# Altium project Snake game PCB.PrjPcb
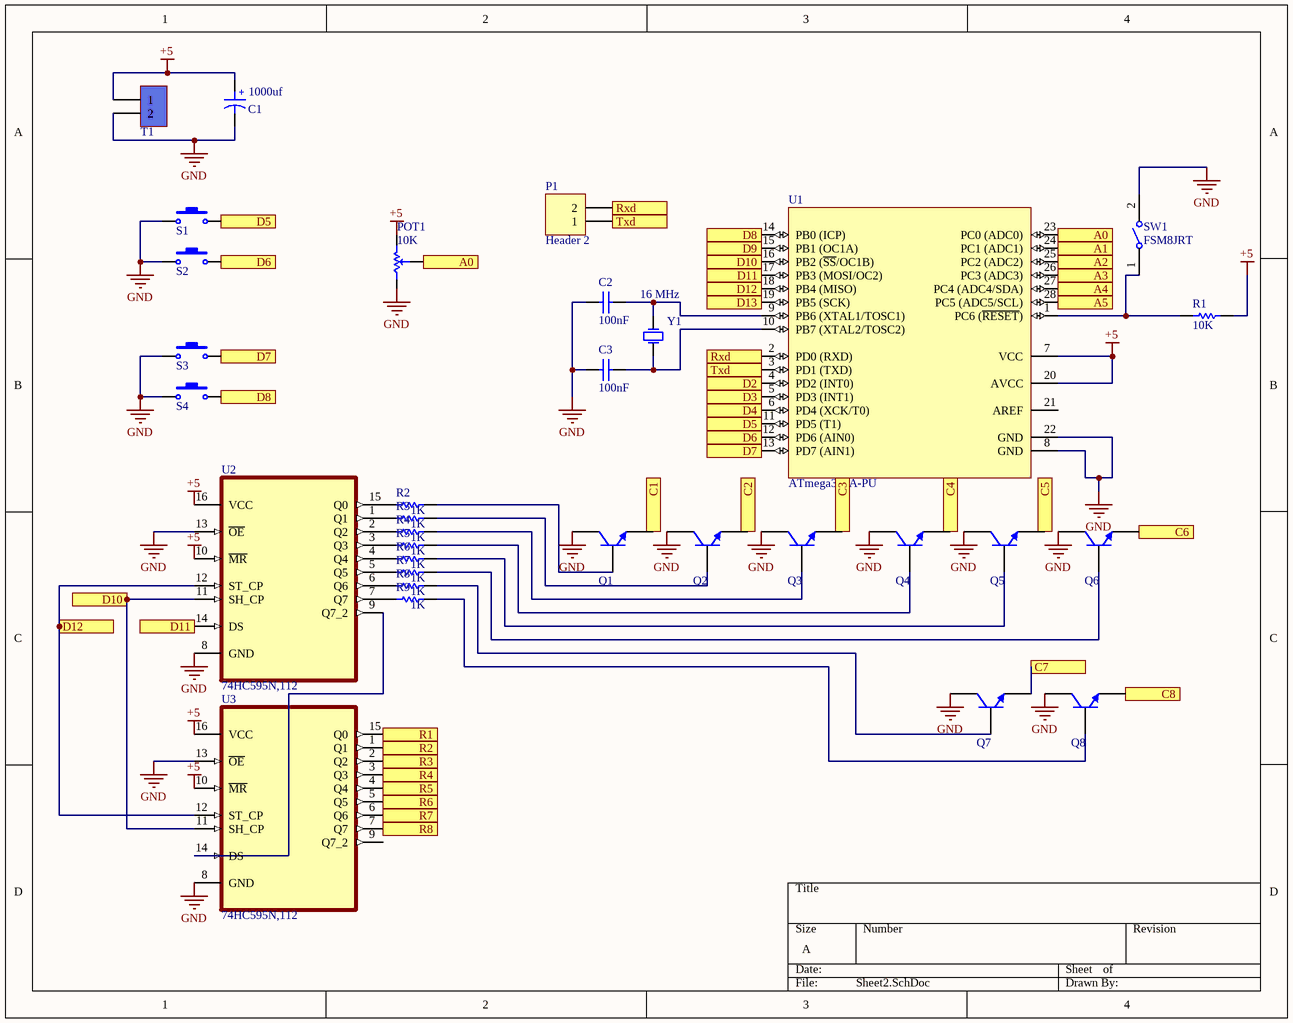
[diagram p0: Sheet2.SchDoc]
2 sheets, 104 parts. Net scope: flat (ports and power ports of the same name join across sheets).
Board file: PCB1.PcbDoc
Sheets:
  Sheet2.SchDoc
  Sheet1.SchDoc

## Sheet Sheet2.SchDoc
size A

### Parts
C1  1000uf  [Cap electrolitic radial 10x20-5]
C2  100nF  [Cap-100nF]
C3  100nF  [Cap-100nF]
P1  Header 2  [HDR1X2]
POT1  10K  [POT]
Q1  BC547  [TO-92 STR]  (value not drawn)
Q2  BC547  [TO-92 STR]  (value not drawn)
Q3  BC547  [TO-92 STR]  (value not drawn)
Q4  BC547  [TO-92 STR]  (value not drawn)
Q5  BC547  [TO-92 STR]  (value not drawn)
Q6  BC547  [TO-92 STR]  (value not drawn)
Q7  BC547  [TO-92 STR]  (value not drawn)
Q8  BC547  [TO-92 STR]  (value not drawn)
R1  10K  [RES-(1/4)]
R2  1K  [RES1206]
R3  1K  [RES1206]
R4  1K  [RES1206]
R5  1K  [RES1206]
R6  1K  [RES1206]
R7  1K  [RES1206]
R8  1K  [RES1206]
R9  1K  [RES1206]
S1  Switch PB  [Switch - Push to On]  (value not drawn)
S2  Switch PB  [Switch - Push to On]  (value not drawn)
S3  Switch PB  [Switch - Push to On]  (value not drawn)
S4  Switch PB  [Switch - Push to On]  (value not drawn)
SW1  FSM8JRT  [TE_FSM8JRT]
T1  Terminal  [Terminal 1*2]  (value not drawn)
U1  ATmega328A-PU  [28P3]
U2  74HC595N,112  [DIP254P762X420-16]
U3  74HC595N,112  [DIP254P762X420-16]
Y1  16 MHz  [XTAL 16MHZ]

### Ports
A0, A1, A2, A3, A4, A5, C1, C2, C3, C4, C5, C6, C7, C8, D2, D3, D4, D5, D6, D7, D8, D9, D10, D11, D12, D13, R1, R2, R3, R4, R5, R6, R7, R8, Rxd, Txd

### Nets
+5: C1.1 POT1.2(CW) R1.2 T1.1 U1.7(VCC) U1.20(AVCC) U2.10(~{MR}) U2.16(VCC) U3.10(~{MR}) U3.16(VCC)
GND: C1.2 C2.2 C3.2 POT1.1(CCW) Q1.1(C) Q2.1(C) Q3.1(C) Q4.1(C) Q5.1(C) Q6.1(C) Q7.1(C) Q8.1(C) S1.1 S2.1 S3.1 S4.1 SW1.2 T1.2 U1.8(GND) U1.22(GND) U2.8(GND) U2.13(~{OE}) U3.8(GND) U3.13(~{OE})
NetC2_1: C2.1 U1.9(PB6_(XTAL1/TOSC1)) Y1.2(OSC2)
NetC3_1: C3.1 U1.10(PB7_(XTAL2/TOSC2)) Y1.1(OSC1)
NetD1_1: Q1.3(E) ; port C1
NetD2_1: Q2.3(E) ; port C2
NetD3_1: Q3.3(E) ; port C3
NetD4_1: Q4.3(E) ; port C4
NetD5_1: Q5.3(E) ; port C5
NetD6_1: Q6.3(E) ; port C6
NetD7_1: Q7.3(E) ; port C7
NetD8_1: Q8.3(E) ; port C8
NetP1_1: P1.1 U1.3(PD1_(TXD)) ; port Txd
NetP1_2: P1.2 U1.2(PD0_(RXD)) ; port Rxd
NetPOT1_3: POT1.3(SetPoint) U1.23(PC0_(ADC0)) ; port A0
NetQ1_2: Q1.2(B) R2.1
NetQ2_2: Q2.2(B) R3.1
NetQ3_2: Q3.2(B) R4.1
NetQ4_2: Q4.2(B) R5.1
NetQ5_2: Q5.2(B) R6.1
NetQ6_2: Q6.2(B) R7.1
NetQ7_2: Q7.2(B) R8.1
NetQ8_2: Q8.2(B) R9.1
NetR1_1: R1.1 SW1.1 U1.1(PC6_(~{RESET}))
NetR2_2: R2.2 U2.15(Q0)
NetR3_2: R3.2 U2.1(Q1)
NetR4_2: R4.2 U2.2(Q2)
NetR5_2: R5.2 U2.3(Q3)
NetR6_2: R6.2 U2.4(Q4)
NetR7_2: R7.2 U2.5(Q5)
NetR8_2: R8.2 U2.6(Q6)
NetR9_2: R9.2 U2.7(Q7)
NetR10_1: U3.15(Q0) ; port R1
NetR11_1: U3.1(Q1) ; port R2
NetR12_1: U3.2(Q2) ; port R3
NetR13_1: U3.3(Q3) ; port R4
NetR14_1: U3.4(Q4) ; port R5
NetR15_1: U3.5(Q5) ; port R6
NetR16_1: U3.6(Q6) ; port R7
NetR17_1: U3.7(Q7) ; port R8
NetS1_2: S1.2 U1.11(PD5_(T1)) ; port D5
NetS2_2: S2.2 U1.12(PD6_(AIN0)) ; port D6
NetS3_2: S3.2 U1.13(PD7_(AIN1)) ; port D7
NetS4_2: S4.2 U1.14(PB0_(ICP)) ; port D8
NetU1_4: U1.4(PD2_(INT0)) ; port D2
NetU1_5: U1.5(PD3_(INT1)) ; port D3
NetU1_6: U1.6(PD4_(XCK/T0)) ; port D4
NetU1_15: U1.15(PB1_(OC1A)) ; port D9
NetU1_16: U1.16(PB2_(~{SS}/OC1B)) U2.11(SH_CP) U3.11(SH_CP) ; port D10
NetU1_17: U1.17(PB3_(MOSI/OC2)) U2.14(DS) ; port D11
NetU1_18: U1.18(PB4_(MISO)) U2.12(ST_CP) U3.12(ST_CP) ; port D12
NetU1_19: U1.19(PB5_(SCK)) ; port D13
NetU1_24: U1.24(PC1_(ADC1)) ; port A1
NetU1_25: U1.25(PC2_(ADC2)) ; port A2
NetU1_26: U1.26(PC3_(ADC3)) ; port A3
NetU1_27: U1.27(PC4_(ADC4/SDA)) ; port A4
NetU1_28: U1.28(PC5_(ADC5/SCL)) ; port A5
NetU2_9: U2.9(Q7_2) U3.14(DS)

Not connected (* = marked no-connect by the designer): U1 21(AREF); U3 9(Q7_2)

### Notes on the sheet
- (in symbol Cap electrolitic radial 10x21) +

### Library data of the parts
C1 = Cap electrolitic radial 10x21: Cap electrolitic radial; Part. No: 100U/50V; Designer: Abbas Basereh; Data: 16-12-2016
C2 C3 = CAP CERAMIC TOTAL SIZE: CAP Ceramic Total; Designer: Ali Hafizi
P1 = Header 2: Header, 2-Pin; LatestRevisionDate: 17-Jul-2002; LatestRevisionNote: Re-released for DXP Platform.; Publisher: Altium Limited
POT1 = POT: Variable Resistor; Value: 10K
Q1-Q8 = BC547: NPN General-purpose Transistor; Designer: Abbas Basereh; Desc.: Plastic Medium-Power. Silicon NPN Transistors; Data: 27-12-2016
R1 = RES DIP PACKAGE: TOTAL DIP RESISTOR PACK; Designer: Ali Hafizi
R2-R9 = RES SMD PACKAGE: TOTAL SMD RESISTOR PACK; Designer: Abbas Basereh; Desc.: RES SMD PAKAGES; Data: 2017-3-10
S1-S4 = Switch PB: Push Button Switch
SW1 = FSM8JRT: Switch Tactile OFF _ON_ SPST Round Button PC Pins 0.05A 12VDC 1.57N Thru-Hole Radial Tape; Contact_Current_Rating: 50 mA; MF: TE Connectivity; Configuration_Pole-Throw: Single Pole - Single Throw; Availability: Unavailable; Price: None; SnapEDA_Link: https://www.snapeda.com/parts/FSM8JRT/TE%20Connectivity%20ALCOSWITCH%20Switches/view-part/226999/?ref=snap; EU_RoHS_Compliance: Compliant; Value: *; Package: None; TE_purchase_URL: https://www.te.com/usa-en/product-147694-1.html?te_bu=Cor&te_type=disp&te_campaign=seda_glo_cor-seda-global-disp-prtnr-fy19-seda-model-bom-cta_sma-317_1&elqCampaignId=32493; MP: FSM8JRT
T1 = Terminal 1*2: Terminal 2 Pin 250VAC 16A; Designer: Seyed Mohsen Ghasemain; E-mail: picpars@gmail.com; ComponentLinkURL: www.picpars.com
U1 = ATmega8A-PU: 8-bit AVR Microcontroller, 8KB Flash, 512 Bytes EEPROM, 1KB SRAM, 28-pin PDIP, Industrial Grade (-40°C to 85°C); Published: 2017-1-5; DatasheetVersion: 2017-1-5; PackageVersion: 2017-1-5; PackageReference: 28P3; Publisher: Abbas Basereh; PackageDescription: 28-lead (0.300"/7.62mm Wide) Plastic Dual Inline Package (PDIP); Supplier 1: Digi-Key; Supplier Part Number 1: ATMEGA8A-PU-ND; Supplier 2: Farnell; Supplier Part Number 2: 1748534; Supplier 3: Mouser; Supplier Part Number 3: 556-ATMEGA8A-PU; ComponentLink1Description: Manufacturer Link; ComponentLink1URL: http://www.atmel.com/products/avr/default.asp?; ComponentLink2Description: ATmega8A Datasheet; ComponentLink2URL: http://www.atmel.com/dyn/resources/prod_documents/doc8159.pdf; ComponentLink3Description: ATmega8A Summary; ComponentLink3URL: http://www.atmel.com/dyn/resources/prod_documents/8159S.pdf; ComponentLink4Description: Atmel.com Home; ComponentLink4URL: http://www.atmel.com
U2 U3 = 74HC595N,112: Shift Shift Register 1 Element 8 Bit 16-DIP; MF: NXP USA; DigiKey-Purchase-URL: https://snapeda.com/shop?store=DigiKey&id=32067; Value: *; Package: DIP-16 NXP Semiconductors; Price: None; SnapEDA_Link: https://www.snapeda.com/parts/74HC595N,112/NXP%20USA%20Inc./view-part/32067/?ref=snap; Availability: Unavailable; MP: 74HC595N,112
Y1 = XTAL: XTAL Crystal; Designer: ABBAS BASEREH; Value: 12 MHz; Design Date: 2017-1-3; ComponentLink1Description: Datasheet; ComponentLink2Description: Reference; Mounting Technology: Surface Mount\Through-Hole; Status: Unreleased

## Sheet Sheet1.SchDoc
size A
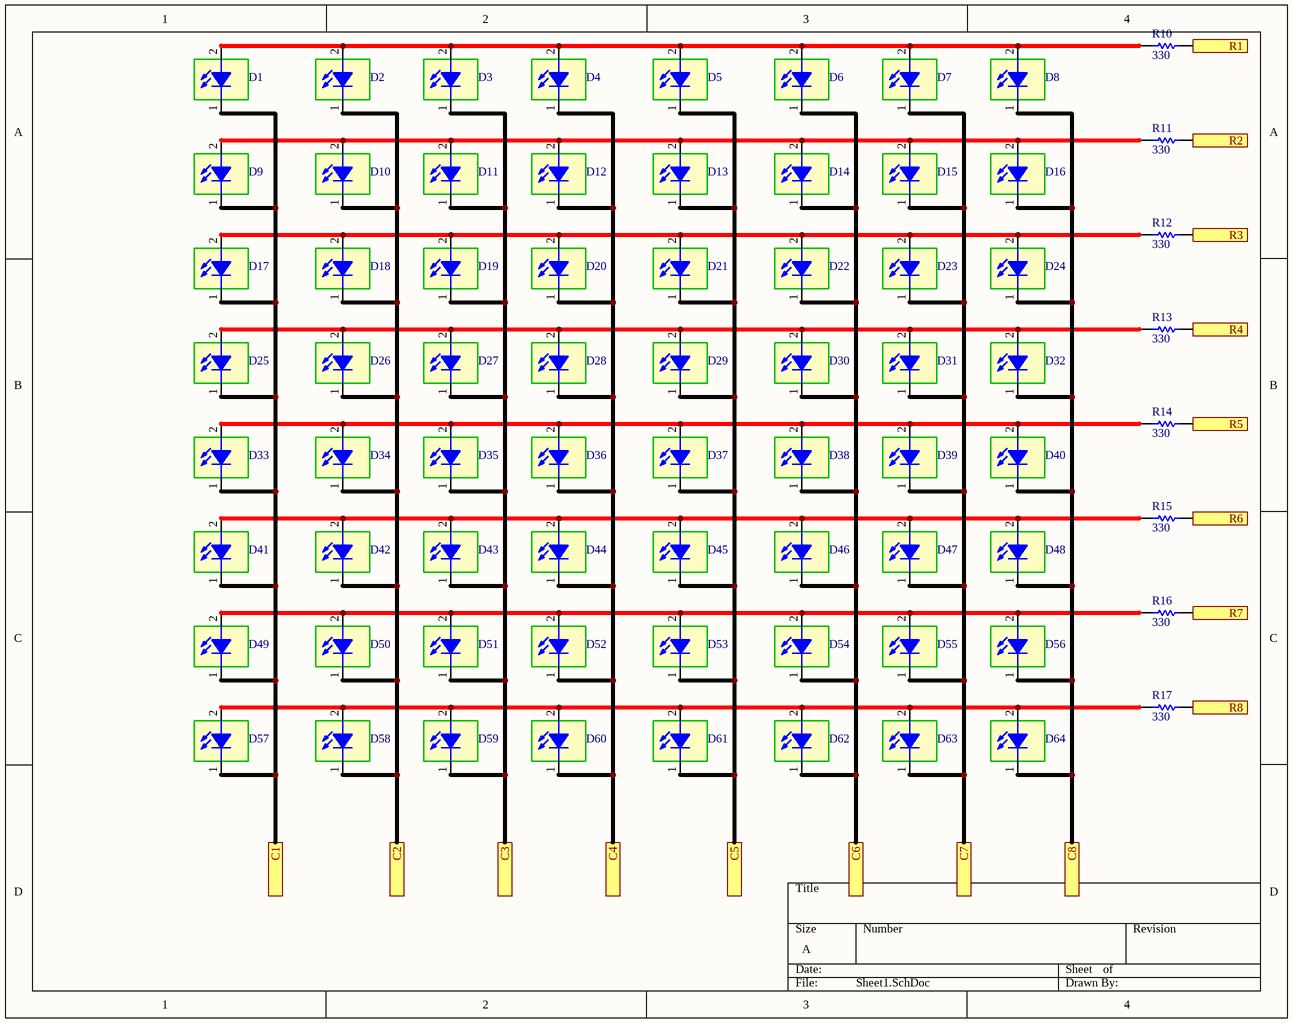
[diagram p1: Sheet1.SchDoc]

### Parts
D1  SMD 1206 LED  [LED 1206]  (value not drawn)
D2  SMD 1206 LED  [LED 1206]  (value not drawn)
D3  SMD 1206 LED  [LED 1206]  (value not drawn)
D4  SMD 1206 LED  [LED 1206]  (value not drawn)
D5  SMD 1206 LED  [LED 1206]  (value not drawn)
D6  SMD 1206 LED  [LED 1206]  (value not drawn)
D7  SMD 1206 LED  [LED 1206]  (value not drawn)
D8  SMD 1206 LED  [LED 1206]  (value not drawn)
D9  SMD 1206 LED  [LED 1206]  (value not drawn)
D10  SMD 1206 LED  [LED 1206]  (value not drawn)
D11  SMD 1206 LED  [LED 1206]  (value not drawn)
D12  SMD 1206 LED  [LED 1206]  (value not drawn)
D13  SMD 1206 LED  [LED 1206]  (value not drawn)
D14  SMD 1206 LED  [LED 1206]  (value not drawn)
D15  SMD 1206 LED  [LED 1206]  (value not drawn)
D16  SMD 1206 LED  [LED 1206]  (value not drawn)
D17  SMD 1206 LED  [LED 1206]  (value not drawn)
D18  SMD 1206 LED  [LED 1206]  (value not drawn)
D19  SMD 1206 LED  [LED 1206]  (value not drawn)
D20  SMD 1206 LED  [LED 1206]  (value not drawn)
D21  SMD 1206 LED  [LED 1206]  (value not drawn)
D22  SMD 1206 LED  [LED 1206]  (value not drawn)
D23  SMD 1206 LED  [LED 1206]  (value not drawn)
D24  SMD 1206 LED  [LED 1206]  (value not drawn)
D25  SMD 1206 LED  [LED 1206]  (value not drawn)
D26  SMD 1206 LED  [LED 1206]  (value not drawn)
D27  SMD 1206 LED  [LED 1206]  (value not drawn)
D28  SMD 1206 LED  [LED 1206]  (value not drawn)
D29  SMD 1206 LED  [LED 1206]  (value not drawn)
D30  SMD 1206 LED  [LED 1206]  (value not drawn)
D31  SMD 1206 LED  [LED 1206]  (value not drawn)
D32  SMD 1206 LED  [LED 1206]  (value not drawn)
D33  SMD 1206 LED  [LED 1206]  (value not drawn)
D34  SMD 1206 LED  [LED 1206]  (value not drawn)
D35  SMD 1206 LED  [LED 1206]  (value not drawn)
D36  SMD 1206 LED  [LED 1206]  (value not drawn)
D37  SMD 1206 LED  [LED 1206]  (value not drawn)
D38  SMD 1206 LED  [LED 1206]  (value not drawn)
D39  SMD 1206 LED  [LED 1206]  (value not drawn)
D40  SMD 1206 LED  [LED 1206]  (value not drawn)
D41  SMD 1206 LED  [LED 1206]  (value not drawn)
D42  SMD 1206 LED  [LED 1206]  (value not drawn)
D43  SMD 1206 LED  [LED 1206]  (value not drawn)
D44  SMD 1206 LED  [LED 1206]  (value not drawn)
D45  SMD 1206 LED  [LED 1206]  (value not drawn)
D46  SMD 1206 LED  [LED 1206]  (value not drawn)
D47  SMD 1206 LED  [LED 1206]  (value not drawn)
D48  SMD 1206 LED  [LED 1206]  (value not drawn)
D49  SMD 1206 LED  [LED 1206]  (value not drawn)
D50  SMD 1206 LED  [LED 1206]  (value not drawn)
D51  SMD 1206 LED  [LED 1206]  (value not drawn)
D52  SMD 1206 LED  [LED 1206]  (value not drawn)
D53  SMD 1206 LED  [LED 1206]  (value not drawn)
D54  SMD 1206 LED  [LED 1206]  (value not drawn)
D55  SMD 1206 LED  [LED 1206]  (value not drawn)
D56  SMD 1206 LED  [LED 1206]  (value not drawn)
D57  SMD 1206 LED  [LED 1206]  (value not drawn)
D58  SMD 1206 LED  [LED 1206]  (value not drawn)
D59  SMD 1206 LED  [LED 1206]  (value not drawn)
D60  SMD 1206 LED  [LED 1206]  (value not drawn)
D61  SMD 1206 LED  [LED 1206]  (value not drawn)
D62  SMD 1206 LED  [LED 1206]  (value not drawn)
D63  SMD 1206 LED  [LED 1206]  (value not drawn)
D64  SMD 1206 LED  [LED 1206]  (value not drawn)
R10  330  [RES1206]
R11  330  [RES1206]
R12  330  [RES1206]
R13  330  [RES1206]
R14  330  [RES1206]
R15  330  [RES1206]
R16  330  [RES1206]
R17  330  [RES1206]

### Ports
C1, C2, C3, C4, C5, C6, C7, C8, R1, R2, R3, R4, R5, R6, R7, R8

### Nets
NetD1_1: D1.1 D9.1 D17.1 D25.1 D33.1 D41.1 D49.1 D57.1 ; port C1
NetD1_2: D1.2 D2.2 D3.2 D4.2 D5.2 D6.2 D7.2 D8.2 R10.2
NetD2_1: D2.1 D10.1 D18.1 D26.1 D34.1 D42.1 D50.1 D58.1 ; port C2
NetD3_1: D3.1 D11.1 D19.1 D27.1 D35.1 D43.1 D51.1 D59.1 ; port C3
NetD4_1: D4.1 D12.1 D20.1 D28.1 D36.1 D44.1 D52.1 D60.1 ; port C4
NetD5_1: D5.1 D13.1 D21.1 D29.1 D37.1 D45.1 D53.1 D61.1 ; port C5
NetD6_1: D6.1 D14.1 D22.1 D30.1 D38.1 D46.1 D54.1 D62.1 ; port C6
NetD7_1: D7.1 D15.1 D23.1 D31.1 D39.1 D47.1 D55.1 D63.1 ; port C7
NetD8_1: D8.1 D16.1 D24.1 D32.1 D40.1 D48.1 D56.1 D64.1 ; port C8
NetD9_2: D9.2 D10.2 D11.2 D12.2 D13.2 D14.2 D15.2 D16.2 R11.2
NetD17_2: D17.2 D18.2 D19.2 D20.2 D21.2 D22.2 D23.2 D24.2 R12.2
NetD25_2: D25.2 D26.2 D27.2 D28.2 D29.2 D30.2 D31.2 D32.2 R13.2
NetD33_2: D33.2 D34.2 D35.2 D36.2 D37.2 D38.2 D39.2 D40.2 R14.2
NetD41_2: D41.2 D42.2 D43.2 D44.2 D45.2 D46.2 D47.2 D48.2 R15.2
NetD49_2: D49.2 D50.2 D51.2 D52.2 D53.2 D54.2 D55.2 D56.2 R16.2
NetD57_2: D57.2 D58.2 D59.2 D60.2 D61.2 D62.2 D63.2 D64.2 R17.2
NetR10_1: R10.1 ; port R1
NetR11_1: R11.1 ; port R2
NetR12_1: R12.1 ; port R3
NetR13_1: R13.1 ; port R4
NetR14_1: R14.1 ; port R5
NetR15_1: R15.1 ; port R6
NetR16_1: R16.1 ; port R7
NetR17_1: R17.1 ; port R8

### Library data of the parts
D1-D64 = LED SMD 1206
R10-R17 = RES SMD PACKAGE: as R2 on sheet Sheet2; Data: 2017-3-10

## Nets that join several sheets
NetD1_1: Sheet2 (Q1.3), Sheet1 (8 pins)
NetD2_1: Sheet2 (Q2.3), Sheet1 (8 pins)
NetD3_1: Sheet2 (Q3.3), Sheet1 (8 pins)
NetD4_1: Sheet2 (Q4.3), Sheet1 (8 pins)
NetD5_1: Sheet2 (Q5.3), Sheet1 (8 pins)
NetD6_1: Sheet2 (Q6.3), Sheet1 (8 pins)
NetD7_1: Sheet2 (Q7.3), Sheet1 (8 pins)
NetD8_1: Sheet2 (Q8.3), Sheet1 (8 pins)
NetR10_1: Sheet2 (U3.15), Sheet1 (R10.1)
NetR11_1: Sheet2 (U3.1), Sheet1 (R11.1)
NetR12_1: Sheet2 (U3.2), Sheet1 (R12.1)
NetR13_1: Sheet2 (U3.3), Sheet1 (R13.1)
NetR14_1: Sheet2 (U3.4), Sheet1 (R14.1)
NetR15_1: Sheet2 (U3.5), Sheet1 (R15.1)
NetR16_1: Sheet2 (U3.6), Sheet1 (R16.1)
NetR17_1: Sheet2 (U3.7), Sheet1 (R17.1)